# Altium schematic sheet Sync.SchDoc
size B
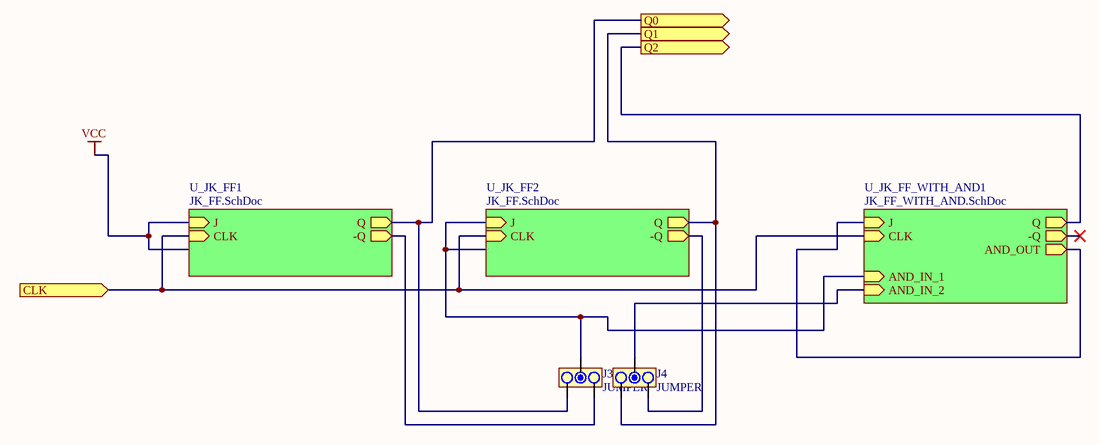
[diagram p0: Sync.SchDoc]

## Parts
J3  JUMPER  [JUMPER3]
J4  JUMPER  [JUMPER3]

## Sub-sheets
U_JK_FF1 = JK_FF.SchDoc: J (in), CLK (in), Q (out), -Q (out)
U_JK_FF2 = JK_FF.SchDoc: J (in), CLK (in), Q (out), -Q (out)
U_JK_FF_WITH_AND1 = JK_FF_WITH_AND.SchDoc: J (in), CLK (in), Q (out), -Q (out), AND_OUT (out), AND_IN_1 (in), AND_IN_2 (in)

## Ports
CLK (in), Q0 (out), Q1 (out), Q2 (out)

## Nets
VCC: sheet U_JK_FF1/J
CLK: port CLK, sheet U_JK_FF_WITH_AND1/CLK, sheet U_JK_FF1/CLK, sheet U_JK_FF2/CLK
Q0: J3.3 ; port Q0, sheet U_JK_FF1/Q
Q1: J4.3 ; port Q1, sheet U_JK_FF2/Q
Q2: port Q2, sheet U_JK_FF_WITH_AND1/Q
NetJ3_1: J3.1 ; sheet U_JK_FF1/-Q
NetJ3_2: J3.2 ; sheet U_JK_FF_WITH_AND1/AND_IN_1, sheet U_JK_FF2/J
NetJ4_1: J4.1 ; sheet U_JK_FF2/-Q
NetJ4_2: J4.2 ; sheet U_JK_FF_WITH_AND1/AND_IN_2
(unnamed): sheet U_JK_FF_WITH_AND1/J, sheet U_JK_FF_WITH_AND1/AND_OUT

## Library data of the parts
J3 J4 = JUMPER3